# EAGLE design 10A Current Sensor v1.0 (EAGLE 9.1.2)

## Sheet 1 of 2
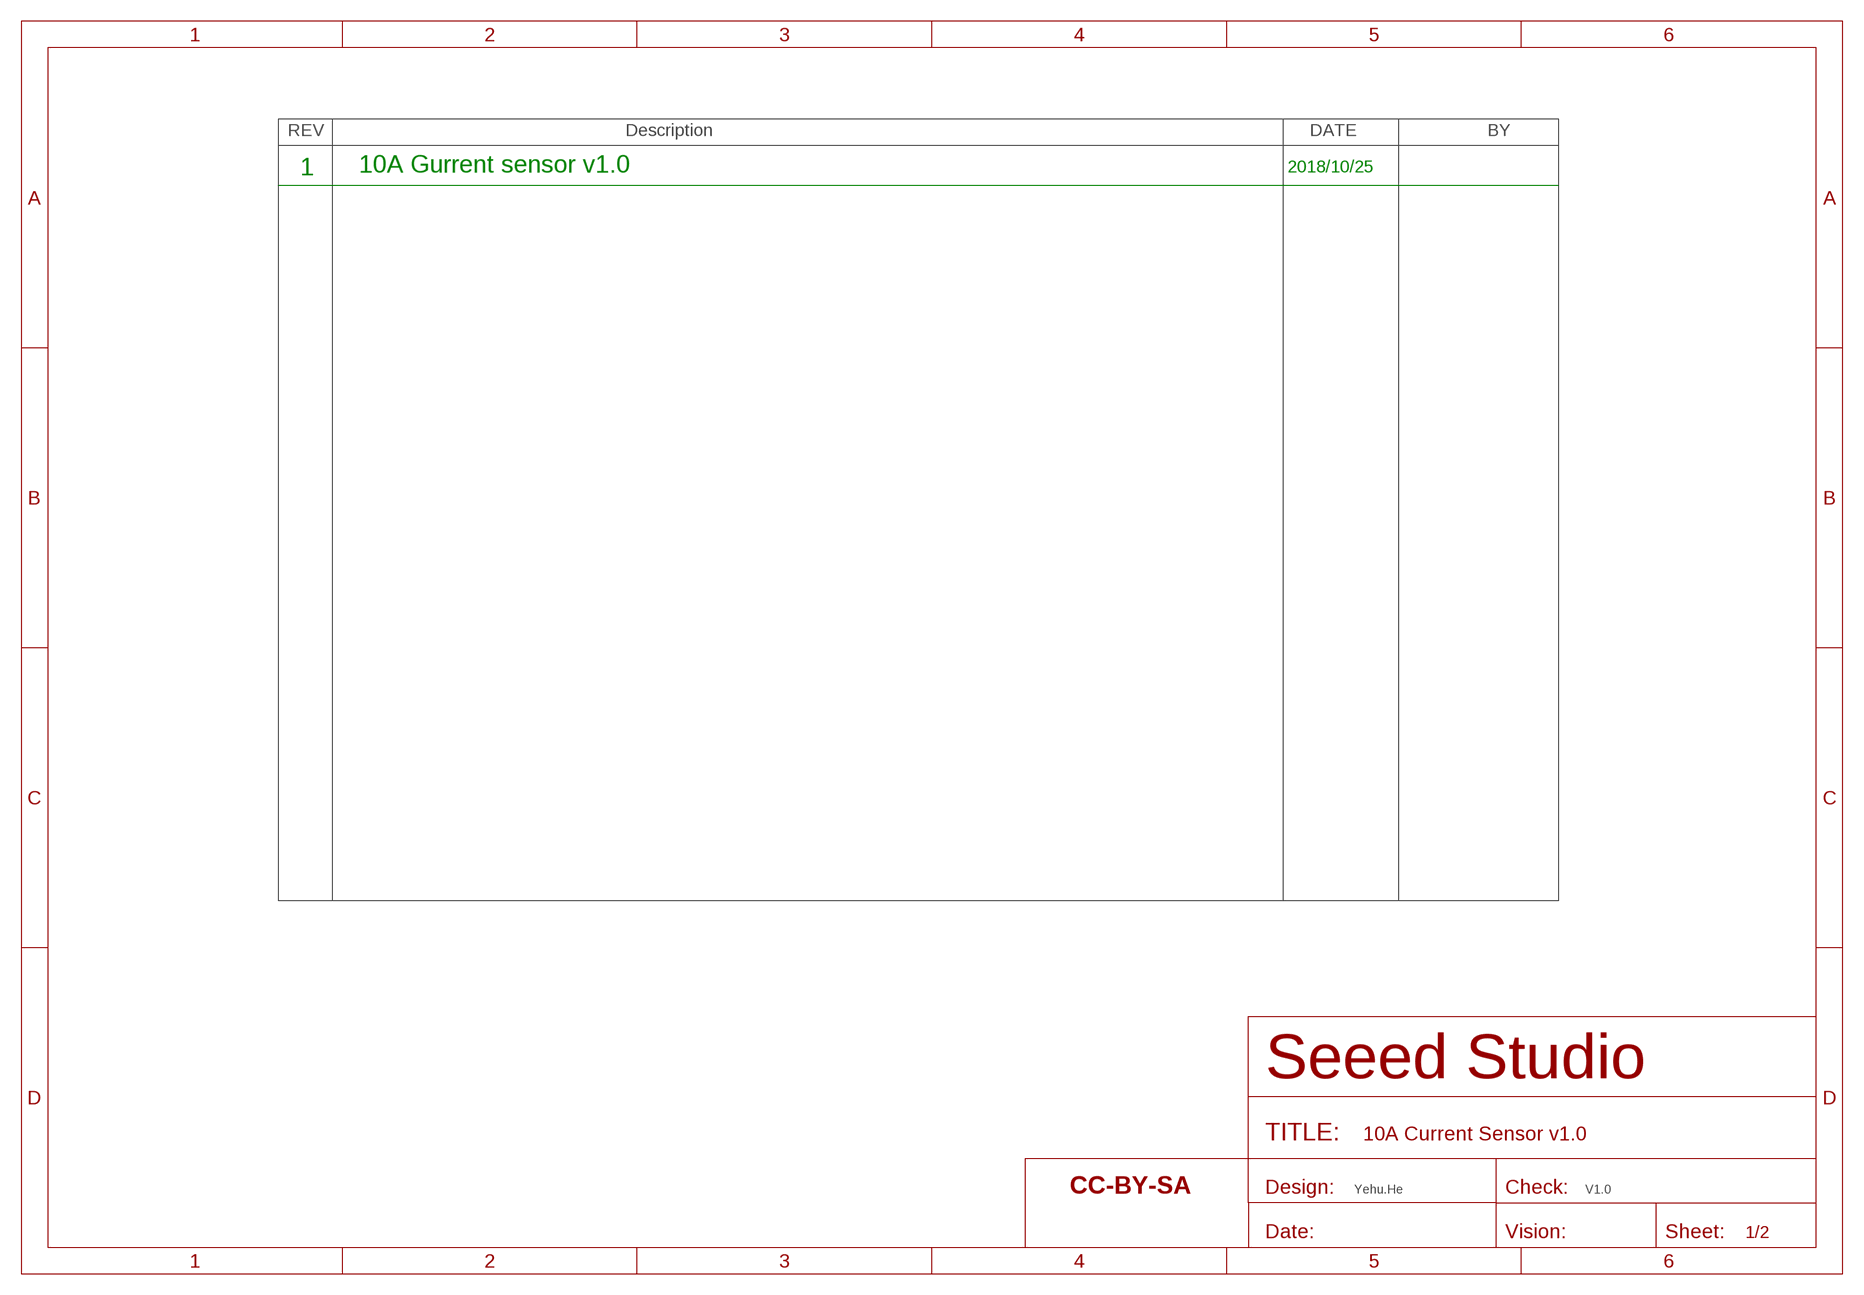
[diagram p0: schematic, sheet 1]

### Parts
FR1  SEEEDSTUDIO-OPEN-SCH-FRAME  [SEEEDSTUDIO-PCB-FRAME]

### Notes on the sheet
- 1 | 10A Gurrent sensor v1.0 | 2018/10/25
- Yehu.He | V1.0

## Sheet 2 of 2
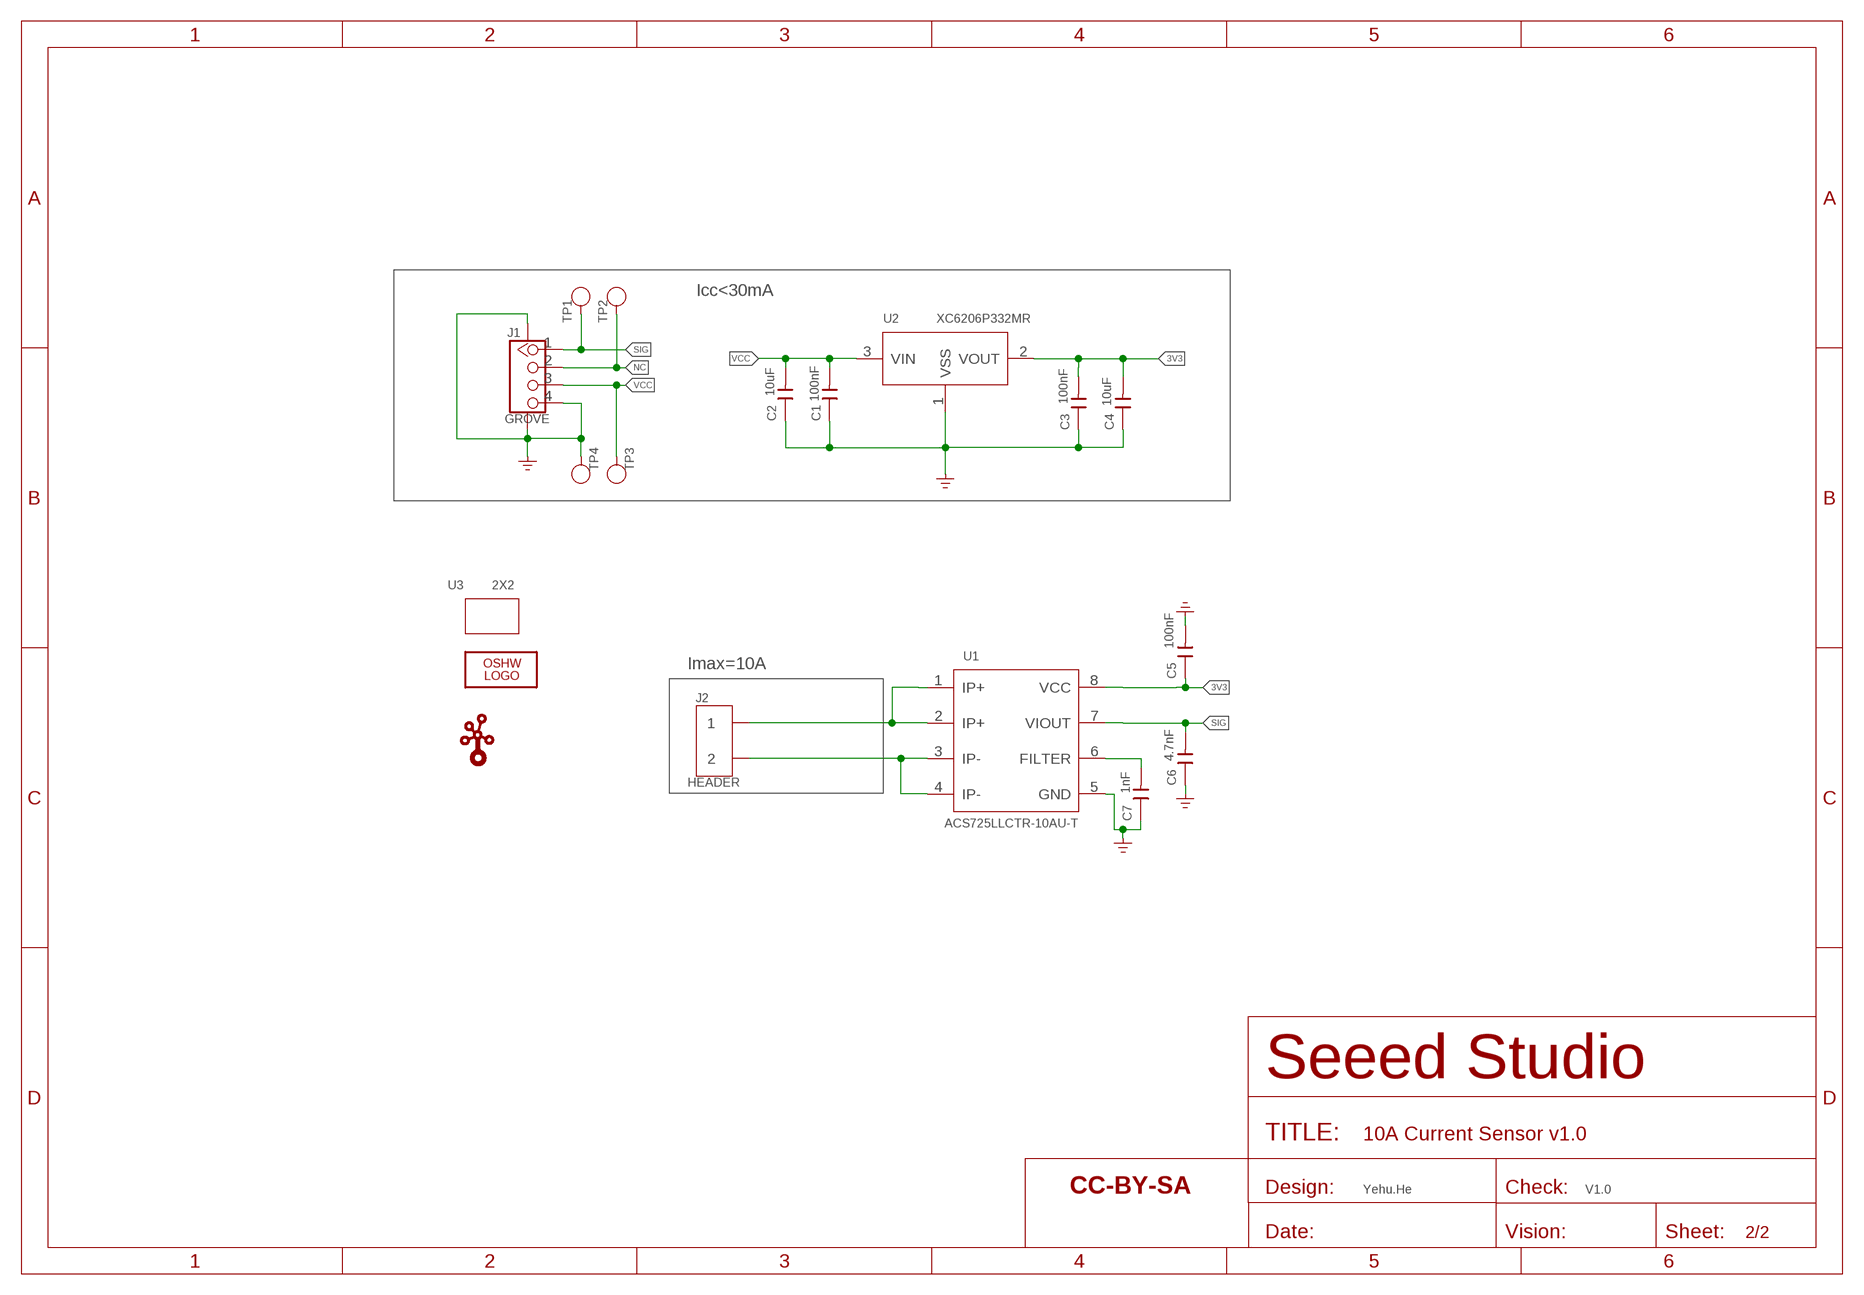
[diagram p1: schematic, sheet 2]

### Parts
C1  100nF  CAP-0603  [C0603]
C2  10uF  CAP-0603  [C0603]
C3  100nF  CAP-0603  [C0603]
C4  10uF  CAP-0603  [C0603]
C5  100nF  CAP-0603  [C0603]
C6  4.7nF  CAP-0603  [C0603]
C7  1nF  CAP-0603  [C0603]
FR2  SEEEDSTUDIO-OPEN-SCH-FRAME  [SEEEDSTUDIO-PCB-FRAME]
J1  GROVE  GROVE-CONNECTOR-SMD'DD'  [HW4-SMD-2.0]
J2  HEADER  SCREW-TERMINAL-2P'5.08'  [H2-5.0-10.5X8.0MM]
LOGO1  LOGO-OSHW-FILLX0200-NT  [OSHW_FILLX200_NOTEXT]
TP1  TEST  TEST-POINT'4545'  [TP-D45MIL]
TP2  TEST  TEST-POINT'4545'  [TP-D45MIL]
TP3  TEST  TEST-POINT'4545'  [TP-D45MIL]
TP4  TEST  TEST-POINT'4545'  [TP-D45MIL]
U1  ACS725LLCTR-10AU-T  SENSOR-ACS725  [SOIC8-1.27-5X4MM]
U2  XC6206P332MR  PMIC-XC6206PMR  [SOT-23]
U3  2X2  GROVE-1X2-TOP  [GROVE-1*2-TEST-PLATFORM-TOP]
U$7  LOGO-GROVE  [GROVE-SILK-BIG]

### Nets
3V3: C3.2 C4.2 C5.1 U1.8(VCC) U2.2(VOUT)
GND: C1.1 C2.1 C3.1 C4.1 C5.2 C6.1 C7.1 J1.4 J1.SS1 J1.SS2 TP4.T U1.5(GND) U2.1(VSS) ; supply symbol labelled GND_POWER
N$1: C7.2 U1.6(FILTER)
N$2: J2.2 U1.3(IP-) U1.4(IP-)
N$3: J2.1 U1.1(IP+) U1.2(IP+)
NC: J1.2 TP2.T
SIG: C6.2 J1.1 TP1.T U1.7(VIOUT)
VCC: C1.2 C2.2 J1.3 TP3.T U2.3(VIN)

### Notes on the sheet
- Icc<30mA
- Imax=10A
- Yehu.He | V1.0

## Library data of the parts
C1-C7 = Discrete-new:CAP: Ceramic Capacitors
FR1 FR2 = moudle-new:SEEEDSTUDIO-OPEN-SCH-FRAME
J1 = Connector-new:GROVE-CONNECTOR-SMD: 4P-SMD-2.0:320110030;4P-SMD-2.0-90D:320110032
J2 = Connector-new:SCREW-TERMINAL-2P: 2P-3.5:320110028;2P-5.0:320110031
LOGO1 = logo:LOGO-OSHW-FILL; PARTNO: DNP
TP1-TP4 = Discrete-new:TEST-POINT; PARTNO: DNP
U1 = Discrete-new:SENSOR-ACS725
U2 = IC-new:PMIC-XC6206P: LOW ESR Cap.Compatible Positive Voltage Regulators
U3 = moudle-new:GROVE
U$7 = logo:LOGO-GROVE; PARTNO: DNP

## Board
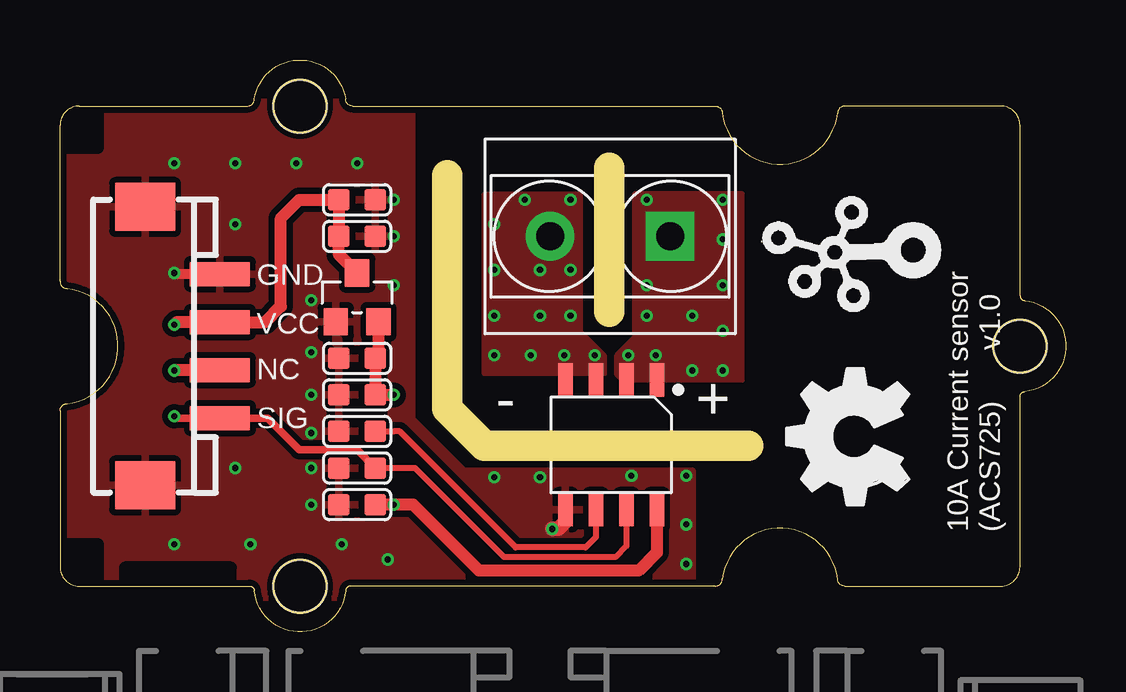
[diagram p2: board, top side]
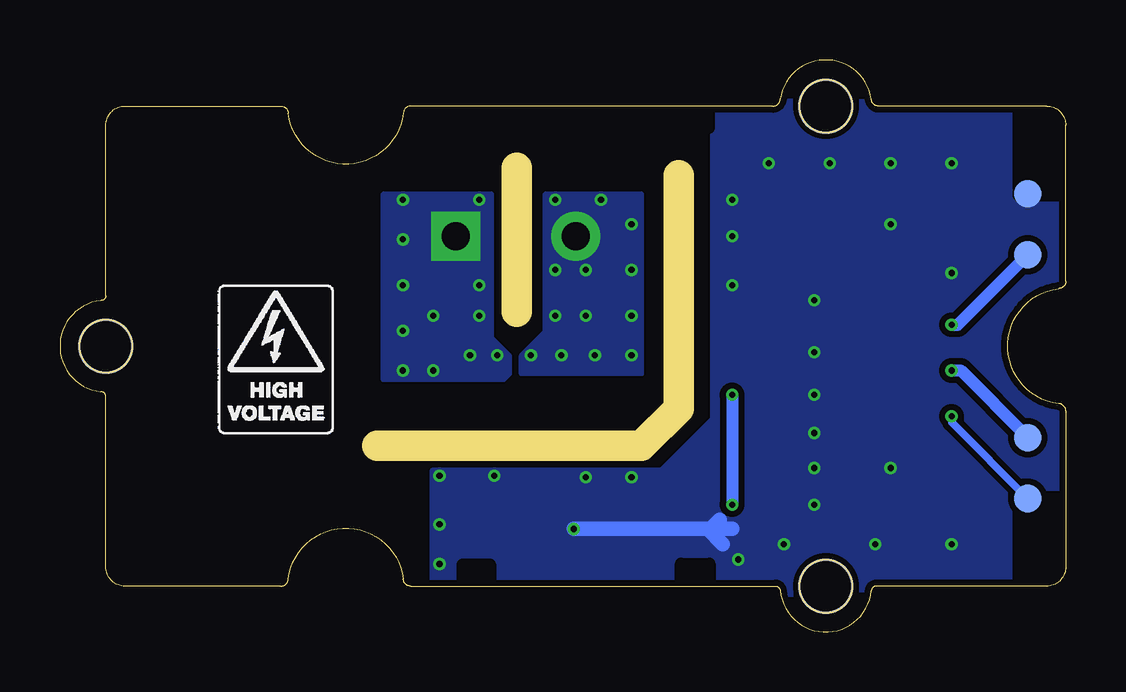
[diagram p3: board, bottom side, seen from below]

Size 41.91 x 23.83 mm. Coordinates in mm from the lower left corner, seen from the top.
Outline: 16.13,19.02 16.13,9.3 17.68,7.75 28.68,7.75
Outline: 22.88,19.35 22.88,13.35
Copper layers (1*16): Top 0.035mm / dielectric 1.5mm / Bottom 0.035mm
Design rules "SeeedStudio_2layer_DRU_no_angle_20140221": minimum track width 1mil, minimum drill 10mil, track to track 6mil, track to pad 6mil, pad to pad 6mil, via to via 6mil, smd to smd 0mil, copper to edge 10mil, drill to drill 10mil, minimum pad ring 4mil, minimum via ring 4mil, stop-mask expansion 2mil, vias tented up to drill 25mil, thermal gap 10mil

### Footprints (pad centres in the part's own frame; a part is rotated, then mirrored left to right if it is on the bottom)
C0603 = smd 0.889 x 0.889: 1 0,0.762; 2 0,-0.762
HW4-SMD-2.0 = smd 1 x 2.5: 1 -3,0; 2 -1,0; 3 1,0; 4 3,0 | smd 2 x 2.5: SS1 -5.8,3.123; SS2 5.8,3.123
H2-5.0-10.5X8.0MM = drill 1.168 pad 2.032 square: 1 0,2.5 | drill 1.168 pad 2.032: 2 0,-2.5
TP-D45MIL = smd 1.143 x 1.143: T 0,0
SOIC8-1.27-5X4MM = smd 0.6 x 1.4: 1 -1.905,-2.7; 2 -0.635,-2.7; 3 0.635,-2.7; 4 1.905,-2.7; 5 1.905,2.7; 6 0.635,2.7; 7 -0.635,2.7; 8 -1.905,2.7
SOT-23 = smd 1.016 x 1.143: 1 -0.889,-1.016; 2 0.889,-1.016; 3 0,1.016
GROVE-1*2-TEST-PLATFORM-TOP = hole 2.2: 10.635,10; 10.635,-10; -19.365,0

### Placement (x,y rotation side)
C1  12.38,16.48 270 top
C2  12.38,18 270 top
C3  12.38,9.88 90 top
C4  12.38,11.4 90 top
C5  12.38,5.3 270 top
C6  12.38,6.83 90 top
C7  12.38,8.35 90 top
FR1  0.06,-16.54 0 top  (outside the outline)
FR2  0.06,-8.92 0 top  (outside the outline)
J1  6.67,11.91 90 top
J2  22.92,16.48 270 top
LOGO1  35.37,5.3 90 top
TP1  1.59,5.56 0 bottom
TP2  1.59,8.1 0 bottom
TP3  1.59,15.72 0 bottom
TP4  1.59,18.26 0 bottom
U1  22.97,7.8 180 top
U2  12.38,13.94 0 top
U3  20.64,11.91 180 top
U$7  35.75,15.85 90 top

### Tracks (layer width: path | path; a pad name or v marks a point on that pad's centre or on a via)
3V3  (via drill 0.25 pad 0.51)
  Top 0.508: U2.2 13.27,11.53 C4.2 C3.2 v13.9,9.88 | C5.1 v13.9,5.3 14.71,5.3 17.46,2.56 20.64,2.56 24.11,2.56 24.87,3.32 U1.8
  Bottom 0.508: v13.9,9.88 v13.9,5.3
GND  (via drill 0.25 pad 0.51)
  Top 0.406: J1.4 4.81,14.91 v4.76,14.96
  Top 0.61: U1.5 21.06,4.59 20.76,4.29 v20.51,4.29
  Bottom 0.61: v20.51,4.29 14.92,4.29 | 14.79,4.29 13.9,4.29 | 14.92,4.29 14.29,3.65 | 14.92,4.29 14.79,4.29 | 14.79,4.29 14.41,4.67
  other vias: 10.48,5.3 10.48,6.83 10.48,8.29 10.48,9.88 10.48,11.65 10.48,13.81 13.9,16.48 13.9,18 12.38,19.53 9.84,19.53 7.3,19.53 4.76,19.53 7.3,16.99 13.9,14.45 13.65,3.02 11.75,3.65 7.94,3.65 4.76,3.65 7.3,6.83 18.1,6.45 20,6.45 23.81,6.51 26.1,6.51 26.1,4.48 26.1,2.83
  pour Bottom (isolate 0.254): -0.32,22.07 14.67,22.07 14.67,8.86 16.83,6.7 26.35,6.7 26.35,1.11 -0.32,1.11
  pour Top (isolate 0.254): -0.32,22.07 14.67,22.07 14.67,8.86 16.83,6.7 26.35,6.7 26.35,1.11 -0.32,1.11
N$1
  Top 0.254: C7.2 13.52,8.35 13.9,8.35 14.16,8.35 18.98,3.53 21.91,3.53 22.33,3.95 U1.6
N$2  (via drill 0.25 pad 0.51)
  other vias: 22.29,11.53 21.02,11.53 19.62,11.53 18.1,11.53 18.1,13.18 18.1,15.08 18.1,16.99 19.37,18 21.27,18 21.27,15.08 21.27,13.18 20,15.08 20,13.18
  pour Top (isolate 0.254, no thermals): 21.68,18.25 21.68,12.5 22.68,11.5 22.68,10.75 17.68,10.75 17.68,18.25
  pour Bottom (isolate 0.254, no thermals): 17.68,18.25 17.68,10.75 22.68,10.75 22.68,11.5 21.68,12.5 21.68,18.25
N$3  (via drill 0.25 pad 0.51)
  other vias: 24.83,11.53 23.68,11.53 26.35,10.89 27.62,10.89 27.62,12.54 27.62,14.45 27.62,16.35 27.62,18 24.45,14.45 24.45,18 24.45,13.18 26.35,13.18
  pour Top (isolate 0.254, no thermals): 23.93,18.25 23.93,12.25 23.18,11.5 23.18,10.75 23.43,10.5 25.43,10.5 28.43,10.5 28.43,18.25
  pour Bottom (isolate 0.254, no thermals): 23.93,18.25 23.93,12.25 23.18,11.5 23.18,10.75 23.43,10.5 28.43,10.5 28.43,18.25
NC  (via drill 0.25 pad 0.51)
  Top 0.508: J1.2 4.78,10.91 v4.76,10.89
  Bottom 0.508: v4.76,10.89 4.38,10.89 TP2.T
SIG  (via drill 0.25 pad 0.51)
  Top 0.254: U1.7 23.6,3.57 23.15,3.12 18.5,3.12 14.79,6.83 C6.2
  Top 0.305: C6.2 12.38,7.59 9.97,7.59 8.65,8.91 J1.1 4.84,8.91 v4.76,8.99 | 23.6,4.67 U1.7
  Bottom 0.305: v4.76,8.99 4.76,8.73 TP1.T
VCC  (via drill 0.25 pad 0.51)
  Top 0.508: U2.3 11.62,15.72 C1.2 C2.2 9.97,18 9.21,17.24 9.21,13.56 8.55,12.91 J1.3 4.87,12.91 v4.76,12.8
  Bottom 0.508: v4.76,12.8 4.51,12.8 TP3.T

### Text on the board
tNames: GND | VCC | NC | SIG | - | + | 10A Current sensor / (ACS725) v1.0